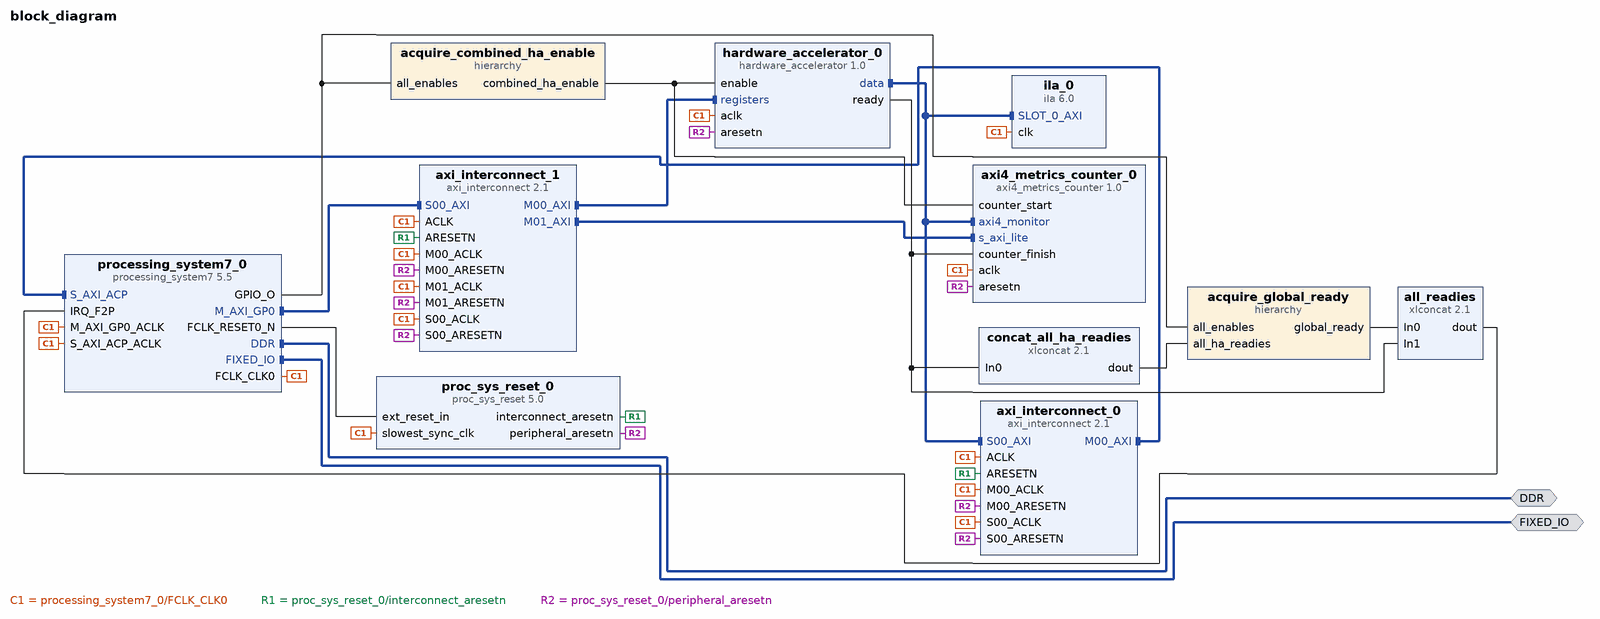
[diagram p0: block diagram of the top level]
# Vivado block design block_diagram, Vivado 2015.3
create_bd_design block_diagram

create_bd_intf_port -mode Master -vlnv xilinx.com:interface:ddrx_rtl:1.0 DDR
create_bd_intf_port -mode Master -vlnv xilinx.com:display_processing_system7:fixedio_rtl:1.0 FIXED_IO

create_bd_cell -type ip -vlnv xilinx.com:ip:processing_system7:5.5 processing_system7_0
set_property -dict [list \
  CONFIG.PCW_USE_S_AXI_ACP 1 \
  CONFIG.PCW_USE_FABRIC_INTERRUPT 1 \
  CONFIG.PCW_IRQ_F2P_INTR 1 \
  CONFIG.PCW_QSPI_GRP_SINGLE_SS_ENABLE 1 \
  CONFIG.PCW_ENET0_PERIPHERAL_ENABLE 0 \
  CONFIG.PCW_SD0_PERIPHERAL_ENABLE 0 \
  CONFIG.PCW_TTC0_PERIPHERAL_ENABLE 1 \
  CONFIG.PCW_TTC0_TTC0_IO {MIO 18 .. 19} \
  CONFIG.PCW_USB0_PERIPHERAL_ENABLE 0 \
  CONFIG.PCW_GPIO_MIO_GPIO_ENABLE 0 \
  CONFIG.PCW_GPIO_EMIO_GPIO_ENABLE 1 \
  CONFIG.PCW_GPIO_EMIO_GPIO_IO 2 \
  CONFIG.preset ZedBoard \
] [get_bd_cells processing_system7_0]
create_bd_cell -type ip -vlnv xilinx.com:ip:proc_sys_reset:5.0 proc_sys_reset_0
create_bd_cell -type ip -vlnv xilinx.com:ip:axi_interconnect:2.1 axi_interconnect_0
set_property -dict {CONFIG.NUM_MI 1} [get_bd_cells axi_interconnect_0]
create_bd_cell -type ip -vlnv xilinx.com:ip:axi_interconnect:2.1 axi_interconnect_1
create_bd_cell -type hier acquire_combined_ha_enable
create_bd_cell -type ip -vlnv xilinx.com:ip:xlconcat:2.1 concat_all_ha_readies
set_property -dict {CONFIG.NUM_PORTS 1} [get_bd_cells concat_all_ha_readies]
create_bd_cell -type hier acquire_global_ready
create_bd_cell -type ip -vlnv xilinx.com:ip:xlconcat:2.1 all_readies
create_bd_cell -type ip -vlnv xilinx.com:ip:ila:6.0 ila_0
set_property -dict {CONFIG.C_DATA_DEPTH 4096} [get_bd_cells ila_0]
create_bd_cell -type ip -vlnv user.org:user:hardware_accelerator:1.0 hardware_accelerator_0
set_property -dict [list \
  CONFIG.C_data_DATA_WIDTH 64 \
  CONFIG.C_data_AWUSER_WIDTH 1 \
  CONFIG.C_data_ARUSER_WIDTH 1 \
  CONFIG.C_data_WUSER_WIDTH 1 \
  CONFIG.C_data_RUSER_WIDTH 1 \
  CONFIG.C_data_BUSER_WIDTH 1 \
] [get_bd_cells hardware_accelerator_0]
create_bd_cell -type ip -vlnv xilinx.com:user:axi4_metrics_counter:1.0 axi4_metrics_counter_0
set_property -dict {CONFIG.C_axi4_monitor_DATA_WIDTH 64} [get_bd_cells axi4_metrics_counter_0]

# ---- hierarchy /acquire_combined_ha_enable ----
current_bd_instance /acquire_combined_ha_enable
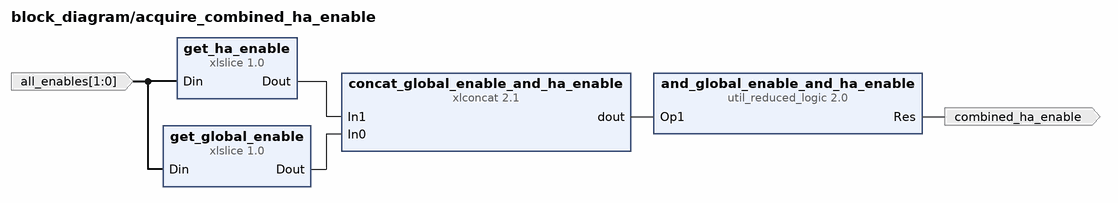
[diagram p1: block diagram inside /acquire_combined_ha_enable]
create_bd_pin -dir I -from 1 -to 0 all_enables
create_bd_pin -dir O combined_ha_enable

create_bd_cell -type ip -vlnv xilinx.com:ip:xlconcat:2.1 concat_global_enable_and_ha_enable
create_bd_cell -type ip -vlnv xilinx.com:ip:xlslice:1.0 get_global_enable
set_property -dict {CONFIG.DIN_TO 0 CONFIG.DIN_FROM 0 CONFIG.DIN_WIDTH 2} [get_bd_cells get_global_enable]
create_bd_cell -type ip -vlnv xilinx.com:ip:xlslice:1.0 get_ha_enable
set_property -dict {CONFIG.DOUT_WIDTH 1 CONFIG.DIN_TO 1 CONFIG.DIN_FROM 1 CONFIG.DIN_WIDTH 2} [get_bd_cells get_ha_enable]
create_bd_cell -type ip -vlnv xilinx.com:ip:util_reduced_logic:2.0 and_global_enable_and_ha_enable
set_property -dict {CONFIG.C_SIZE 2} [get_bd_cells and_global_enable_and_ha_enable]

# ---- hierarchy /acquire_global_ready ----
current_bd_instance /acquire_global_ready
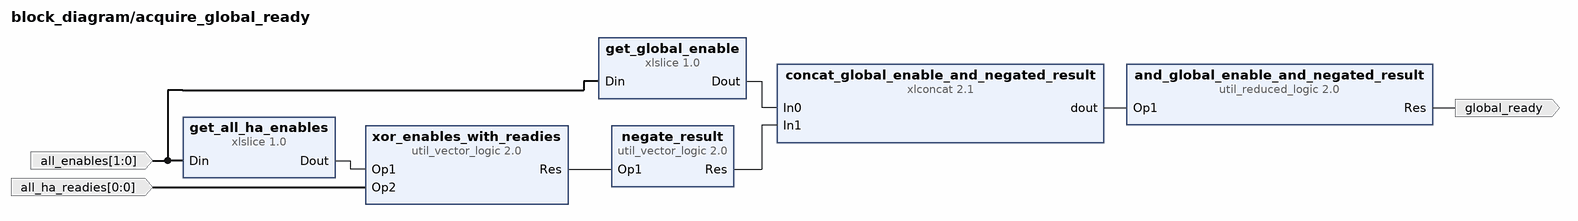
[diagram p2: block diagram inside /acquire_global_ready]
create_bd_pin -dir I -from 0 -to 0 all_ha_readies
create_bd_pin -dir I -from 1 -to 0 all_enables
create_bd_pin -dir O global_ready

create_bd_cell -type ip -vlnv xilinx.com:ip:util_vector_logic:2.0 xor_enables_with_readies
set_property -dict {CONFIG.C_SIZE 1 CONFIG.C_OPERATION xor} [get_bd_cells xor_enables_with_readies]
create_bd_cell -type ip -vlnv xilinx.com:ip:xlslice:1.0 get_global_enable
set_property -dict {CONFIG.DIN_TO 0 CONFIG.DIN_FROM 0 CONFIG.DIN_WIDTH 2} [get_bd_cells get_global_enable]
create_bd_cell -type ip -vlnv xilinx.com:ip:xlconcat:2.1 concat_global_enable_and_negated_result
create_bd_cell -type ip -vlnv xilinx.com:ip:xlslice:1.0 get_all_ha_enables
set_property -dict {CONFIG.DIN_TO 1 CONFIG.DIN_FROM 1 CONFIG.DIN_WIDTH 2} [get_bd_cells get_all_ha_enables]
create_bd_cell -type ip -vlnv xilinx.com:ip:util_vector_logic:2.0 negate_result
set_property -dict {CONFIG.C_SIZE 1 CONFIG.C_OPERATION not} [get_bd_cells negate_result]
create_bd_cell -type ip -vlnv xilinx.com:ip:util_reduced_logic:2.0 and_global_enable_and_negated_result
set_property -dict {CONFIG.C_SIZE 2} [get_bd_cells and_global_enable_and_negated_result]

# ---- connections ----

current_bd_instance /acquire_combined_ha_enable
connect_bd_net -net xlslice_0_Dout [get_bd_pins get_global_enable/Dout] [get_bd_pins concat_global_enable_and_ha_enable/In0]
connect_bd_net -net xlslice_1_Dout [get_bd_pins get_ha_enable/Dout] [get_bd_pins concat_global_enable_and_ha_enable/In1]
connect_bd_net -net xlconcat_0_dout [get_bd_pins concat_global_enable_and_ha_enable/dout] [get_bd_pins and_global_enable_and_ha_enable/Op1]
connect_bd_net -net processing_system7_0_GPIO_O [get_bd_pins all_enables] [get_bd_pins get_ha_enable/Din] [get_bd_pins get_global_enable/Din]
connect_bd_net -net util_reduced_logic_0_Res [get_bd_pins and_global_enable_and_ha_enable/Res] [get_bd_pins combined_ha_enable]

current_bd_instance /acquire_global_ready
connect_bd_net -net xlslice_1_Dout [get_bd_pins get_all_ha_enables/Dout] [get_bd_pins xor_enables_with_readies/Op1]
connect_bd_net -net util_vector_logic_0_Res [get_bd_pins xor_enables_with_readies/Res] [get_bd_pins negate_result/Op1]
connect_bd_net -net xlslice_0_Dout [get_bd_pins get_global_enable/Dout] [get_bd_pins concat_global_enable_and_negated_result/In0]
connect_bd_net -net util_vector_logic_1_Res [get_bd_pins negate_result/Res] [get_bd_pins concat_global_enable_and_negated_result/In1]
connect_bd_net -net xlconcat_1_dout [get_bd_pins concat_global_enable_and_negated_result/dout] [get_bd_pins and_global_enable_and_negated_result/Op1]
connect_bd_net -net xlconcat_0_dout [get_bd_pins all_ha_readies] [get_bd_pins xor_enables_with_readies/Op2]
connect_bd_net -net processing_system7_0_GPIO_O [get_bd_pins all_enables] [get_bd_pins get_all_ha_enables/Din] [get_bd_pins get_global_enable/Din]
connect_bd_net [get_bd_pins and_global_enable_and_negated_result/Res] [get_bd_pins global_ready]

current_bd_instance /
connect_bd_intf_net [get_bd_intf_pins hardware_accelerator_0/data] [get_bd_intf_pins axi_interconnect_0/S00_AXI]
connect_bd_intf_net [get_bd_intf_pins hardware_accelerator_0/data] [get_bd_intf_pins ila_0/SLOT_0_AXI]
connect_bd_intf_net [get_bd_intf_pins hardware_accelerator_0/data] [get_bd_intf_pins axi4_metrics_counter_0/axi4_monitor]
connect_bd_intf_net [get_bd_intf_pins axi_interconnect_0/M00_AXI] [get_bd_intf_pins processing_system7_0/S_AXI_ACP]
connect_bd_intf_net [get_bd_intf_pins processing_system7_0/M_AXI_GP0] [get_bd_intf_pins axi_interconnect_1/S00_AXI]
connect_bd_intf_net [get_bd_intf_pins axi_interconnect_1/M01_AXI] [get_bd_intf_pins axi4_metrics_counter_0/s_axi_lite]
connect_bd_intf_net [get_bd_intf_pins axi_interconnect_1/M00_AXI] [get_bd_intf_pins hardware_accelerator_0/registers]
connect_bd_intf_net [get_bd_intf_ports DDR] [get_bd_intf_pins processing_system7_0/DDR]
connect_bd_intf_net [get_bd_intf_ports FIXED_IO] [get_bd_intf_pins processing_system7_0/FIXED_IO]
connect_bd_net [get_bd_pins processing_system7_0/FCLK_RESET0_N] [get_bd_pins proc_sys_reset_0/ext_reset_in]
connect_bd_net [get_bd_pins processing_system7_0/FCLK_CLK0] \
  [get_bd_pins processing_system7_0/M_AXI_GP0_ACLK] [get_bd_pins processing_system7_0/S_AXI_ACP_ACLK] \
  [get_bd_pins proc_sys_reset_0/slowest_sync_clk] [get_bd_pins ila_0/clk] [get_bd_pins hardware_accelerator_0/aclk] \
  [get_bd_pins axi_interconnect_0/ACLK] [get_bd_pins axi_interconnect_0/S00_ACLK] [get_bd_pins axi_interconnect_0/M00_ACLK] \
  [get_bd_pins axi_interconnect_1/ACLK] [get_bd_pins axi_interconnect_1/S00_ACLK] [get_bd_pins axi_interconnect_1/M00_ACLK] \
  [get_bd_pins axi_interconnect_1/M01_ACLK] [get_bd_pins axi4_metrics_counter_0/aclk]
connect_bd_net [get_bd_pins proc_sys_reset_0/interconnect_aresetn] [get_bd_pins axi_interconnect_0/ARESETN] [get_bd_pins axi_interconnect_1/ARESETN]
connect_bd_net [get_bd_pins proc_sys_reset_0/peripheral_aresetn] \
  [get_bd_pins hardware_accelerator_0/aresetn] [get_bd_pins axi_interconnect_0/S00_ARESETN] \
  [get_bd_pins axi_interconnect_0/M00_ARESETN] [get_bd_pins axi_interconnect_1/S00_ARESETN] \
  [get_bd_pins axi_interconnect_1/M00_ARESETN] [get_bd_pins axi_interconnect_1/M01_ARESETN] \
  [get_bd_pins axi4_metrics_counter_0/aresetn]
connect_bd_net [get_bd_pins processing_system7_0/GPIO_O] \
  [get_bd_pins acquire_combined_ha_enable/all_enables] [get_bd_pins acquire_global_ready/all_enables]
connect_bd_net -net util_reduced_logic_0_Res [get_bd_pins acquire_combined_ha_enable/combined_ha_enable] \
  [get_bd_pins hardware_accelerator_0/enable] [get_bd_pins axi4_metrics_counter_0/counter_start]
connect_bd_net [get_bd_pins hardware_accelerator_0/ready] \
  [get_bd_pins concat_all_ha_readies/In0] [get_bd_pins all_readies/In1] [get_bd_pins axi4_metrics_counter_0/counter_finish]
connect_bd_net -net xlconcat_0_dout [get_bd_pins concat_all_ha_readies/dout] [get_bd_pins acquire_global_ready/all_ha_readies]
connect_bd_net -net xlconcat_0_dout1 [get_bd_pins all_readies/dout] [get_bd_pins processing_system7_0/IRQ_F2P]
connect_bd_net -net hier_1_Res [get_bd_pins acquire_global_ready/global_ready] [get_bd_pins all_readies/In0]

# ---- address map ----
assign_bd_address -offset 0x00000000 -range 512M -target_address_space [get_bd_addr_spaces hardware_accelerator_0/data] [get_bd_addr_segs processing_system7_0/S_AXI_ACP/ACP_DDR_LOWOCM]
assign_bd_address -offset 0x40000000 -range 1G -target_address_space [get_bd_addr_spaces hardware_accelerator_0/data] [get_bd_addr_segs processing_system7_0/S_AXI_ACP/ACP_M_AXI_GP0]
assign_bd_address -offset 0xE0000000 -range 4M -target_address_space [get_bd_addr_spaces hardware_accelerator_0/data] [get_bd_addr_segs processing_system7_0/S_AXI_ACP/ACP_IOP]
assign_bd_address -offset 0xFC000000 -range 16M -target_address_space [get_bd_addr_spaces hardware_accelerator_0/data] [get_bd_addr_segs processing_system7_0/S_AXI_ACP/ACP_QSPI_LINEAR]
assign_bd_address -offset 0x43C00000 -range 64K -target_address_space [get_bd_addr_spaces processing_system7_0/Data] [get_bd_addr_segs axi4_metrics_counter_0/s_axi_lite/s_axi_lite_reg]
assign_bd_address -offset 0x43C10000 -range 64K -target_address_space [get_bd_addr_spaces processing_system7_0/Data] [get_bd_addr_segs hardware_accelerator_0/registers/registers_reg]

validate_bd_design
save_bd_design
